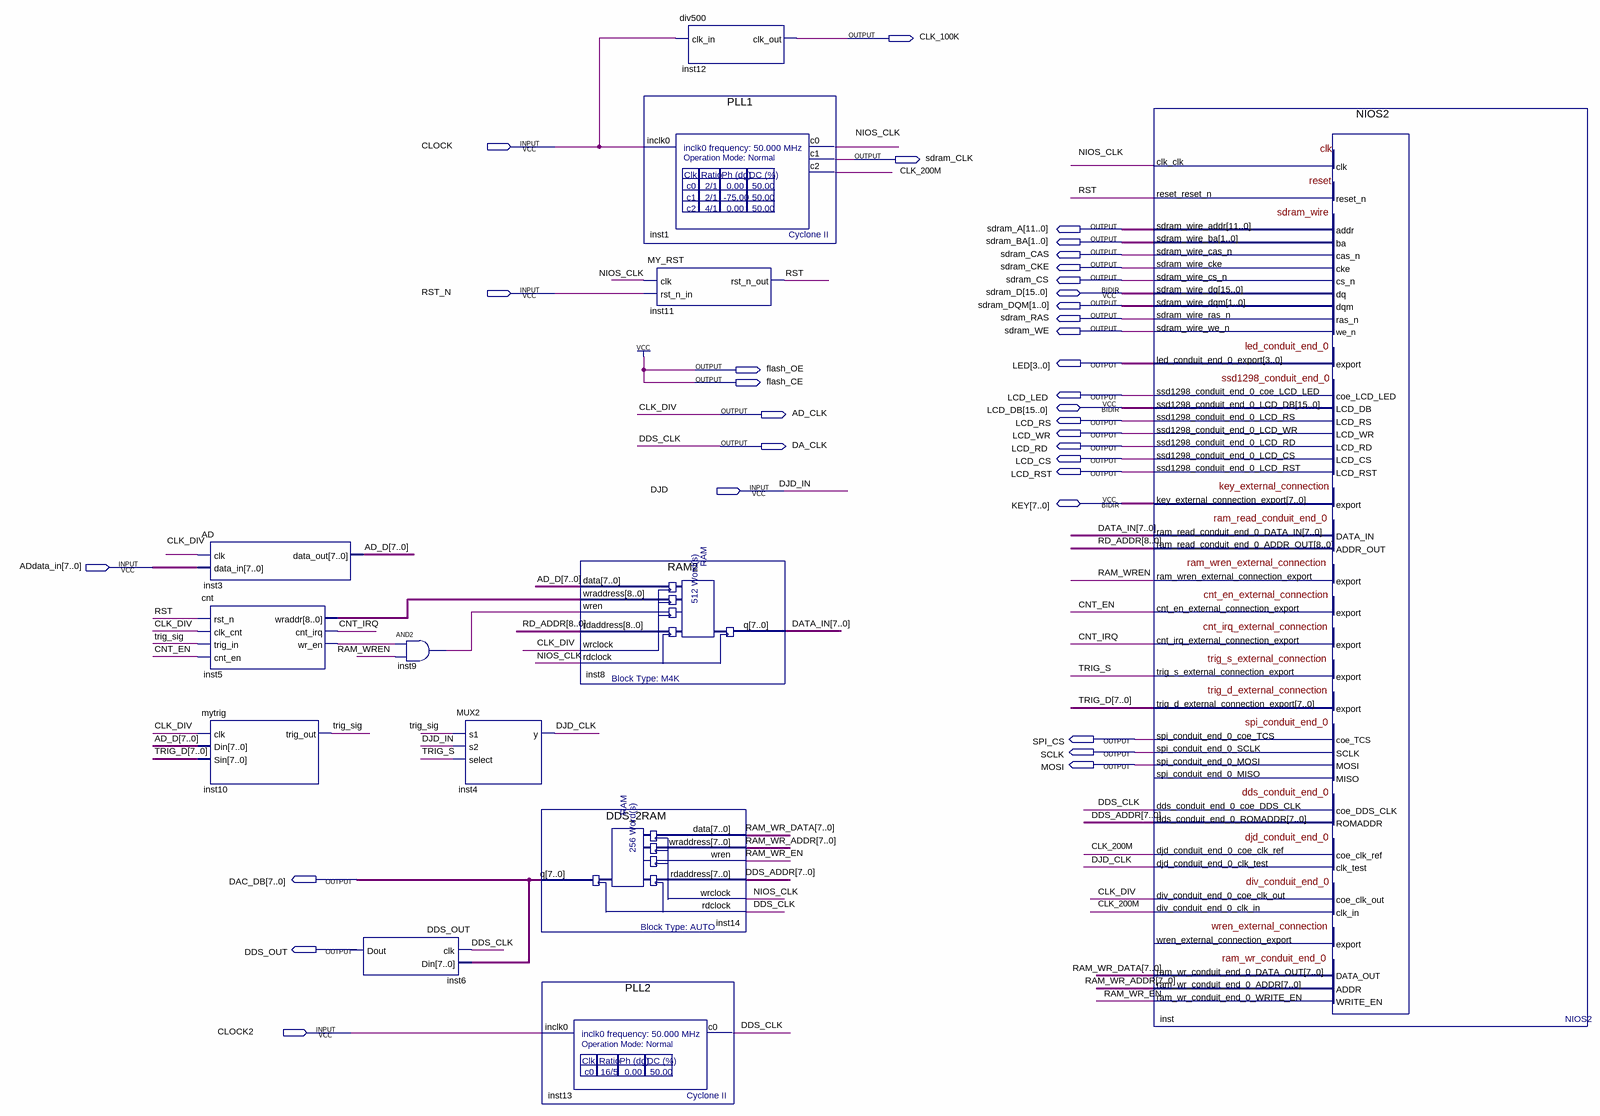
[diagram p0: schematic sheet]
// Quartus schematic DSO.bdf as structural Verilog: 13 symbols, 34 pins
module DSO (
  input  CLOCK,
  input  RST_N,
  input  DJD,
  input  [7:0] ADdata_in,
  input  CLOCK2,
  inout  [15:0] sdram_D,
  inout  [15:0] LCD_DB,
  inout  [7:0] KEY,
  output CLK_100K,
  output sdram_CLK,
  output [11:0] sdram_A,
  output [1:0] sdram_BA,
  output sdram_CAS,
  output sdram_CKE,
  output sdram_CS,
  output [1:0] sdram_DQM,
  output sdram_RAS,
  output sdram_WE,
  output [3:0] LED,
  output flash_OE,
  output flash_CE,
  output LCD_LED,
  output AD_CLK,
  output LCD_RS,
  output LCD_WR,
  output DA_CLK,
  output LCD_RD,
  output LCD_CS,
  output LCD_RST,
  output SPI_CS,
  output SCLK,
  output MOSI,
  output [7:0] DAC_DB,
  output DDS_OUT
);

  wire CLK_200M, CNT_EN, CNT_IRQ, DJD_CLK, inst5_wr_en, inst9_out, NIOS_CLK, RAM_WR_EN, RAM_WREN, RST,
       TRIG_S, trig_sig;
  wire [7:0] AD_D, DATA_IN, DDS_ADDR, RAM_WR_ADDR, RAM_WR_DATA, TRIG_D;
  wire [8:0] inst5_wraddr, RD_ADDR;

  AD inst3 (.clk(AD_CLK), .data_in(ADdata_in), .data_out(AD_D));
  cnt inst5 (
    .rst_n(RST), .clk_cnt(AD_CLK), .trig_in(trig_sig), .cnt_en(CNT_EN), .wraddr(inst5_wraddr),
    .cnt_irq(CNT_IRQ), .wr_en(inst5_wr_en));
  mytrig inst10 (.clk(AD_CLK), .Din(AD_D), .Sin(TRIG_D), .trig_out(trig_sig));
  DDS_OUT inst6 (.clk(DA_CLK), .Din(DAC_DB), .Dout(DDS_OUT));
  and inst9 (inst9_out, inst5_wr_en, RAM_WREN);
  MUX2 inst4 (.s1(trig_sig), .s2(DJD), .select(TRIG_S), .y(DJD_CLK));
  RAM2 inst8 (
    .data(AD_D), .wraddress(inst5_wraddr), .wren(inst9_out), .rdaddress(RD_ADDR), .wrclock(AD_CLK),
    .rdclock(NIOS_CLK), .q(DATA_IN));
  DDS_2RAM inst14 (
    .data(RAM_WR_DATA), .wraddress(RAM_WR_ADDR), .wren(RAM_WR_EN), .rdaddress(DDS_ADDR), .wrclock(NIOS_CLK),
    .rdclock(DA_CLK), .q(DAC_DB));
  PLL2 inst13 (.inclk0(CLOCK2), .c0(DA_CLK));
  div500 inst12 (.clk_in(CLOCK), .clk_out(CLK_100K));
  PLL1 inst1 (.inclk0(CLOCK), .c0(NIOS_CLK), .c1(sdram_CLK), .c2(CLK_200M));
  MY_RST inst11 (.clk(NIOS_CLK), .rst_n_in(RST_N), .rst_n_out(RST));
  NIOS2 inst (
    .clk_clk(NIOS_CLK), .reset_reset_n(RST), .ram_read_conduit_end_0_DATA_IN(DATA_IN),
    .cnt_irq_external_connection_export(CNT_IRQ), .dds_conduit_end_0_coe_DDS_CLK(DA_CLK),
    .djd_conduit_end_0_coe_clk_ref(CLK_200M), .djd_conduit_end_0_clk_test(DJD_CLK),
    .div_conduit_end_0_clk_in(CLK_200M), .sdram_wire_addr(sdram_A), .sdram_wire_ba(sdram_BA),
    .sdram_wire_cas_n(sdram_CAS), .sdram_wire_cke(sdram_CKE), .sdram_wire_cs_n(sdram_CS),
    .sdram_wire_dqm(sdram_DQM), .sdram_wire_ras_n(sdram_RAS), .sdram_wire_we_n(sdram_WE),
    .led_conduit_end_0_export(LED), .ssd1298_conduit_end_0_coe_LCD_LED(LCD_LED),
    .ssd1298_conduit_end_0_LCD_RS(LCD_RS), .ssd1298_conduit_end_0_LCD_WR(LCD_WR),
    .ssd1298_conduit_end_0_LCD_RD(LCD_RD), .ssd1298_conduit_end_0_LCD_CS(LCD_CS),
    .ssd1298_conduit_end_0_LCD_RST(LCD_RST), .ram_read_conduit_end_0_ADDR_OUT(RD_ADDR),
    .ram_wren_external_connection_export(RAM_WREN), .cnt_en_external_connection_export(CNT_EN),
    .trig_s_external_connection_export(TRIG_S), .trig_d_external_connection_export(TRIG_D),
    .spi_conduit_end_0_coe_TCS(SPI_CS), .spi_conduit_end_0_SCLK(SCLK), .spi_conduit_end_0_MOSI(MOSI),
    .dds_conduit_end_0_ROMADDR(DDS_ADDR), .div_conduit_end_0_coe_clk_out(AD_CLK),
    .ram_wr_conduit_end_0_DATA_OUT(RAM_WR_DATA), .ram_wr_conduit_end_0_ADDR(RAM_WR_ADDR),
    .ram_wr_conduit_end_0_WRITE_EN(RAM_WR_EN), .sdram_wire_dq(sdram_D),
    .ssd1298_conduit_end_0_LCD_DB(LCD_DB), .key_external_connection_export(KEY));  // open: spi_conduit_end_0_MISO, wren_external_connection_export

  assign flash_CE = 1'b1;
  assign flash_OE = 1'b1;

  // Other names for the same wires on the sheet: CLK_DIV = AD_CLK; DDS_CLK = DA_CLK; DJD_IN = DJD
endmodule
